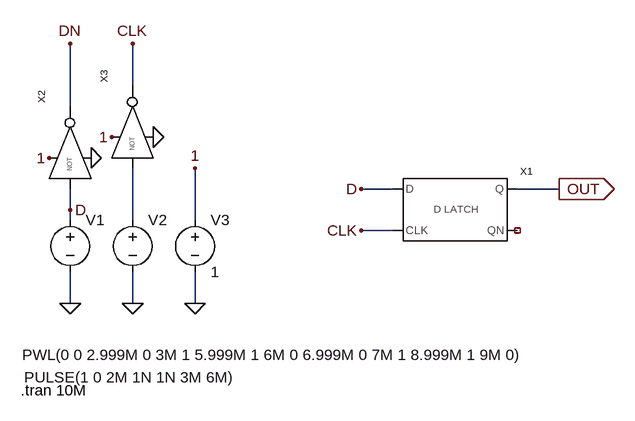
[diagram p0: schematic Draft37.asc]
Draft37.asc, the LTspice schematic file:
Version 4
SHEET 1 880 680
WIRE -352 -16 -352 -80
WIRE -448 16 -448 -80
WIRE 48 144 0 144
WIRE 304 144 240 144
WIRE -448 176 -448 144
WIRE -448 192 -448 176
WIRE -352 192 -352 112
WIRE -256 192 -256 112
WIRE 48 208 0 208
WIRE -448 320 -448 272
WIRE -352 320 -352 272
WIRE -256 320 -256 272
FLAG -448 320 0
FLAG -352 320 0
FLAG -416 96 0
FLAG -256 112 1
FLAG -480 96 1
FLAG -448 -80 DN
FLAG -448 176 D
FLAG -352 -80 CLK
FLAG -256 320 0
FLAG -384 64 1
FLAG -320 64 0
FLAG 0 144 D
FLAG 0 208 CLK
FLAG 304 144 OUT
IOPIN 304 144 Out
SYMBOL D_LATCH 128 176 R0
SYMATTR InstName X1
SYMBOL voltage -448 176 R0
WINDOW 3 -74 223 Left 2
WINDOW 123 0 0 Left 0
WINDOW 39 0 0 Left 0
SYMATTR Value PWL(0 0 2.999M 0 3M 1 5.999M 1 6M 0 6.999M 0 7M 1 8.999M 1 9M 0)
SYMATTR InstName V1
SYMBOL voltage -352 176 R0
WINDOW 3 -167 258 Left 2
WINDOW 123 0 0 Left 0
WINDOW 39 0 0 Left 0
SYMATTR Value PULSE(1 0 2M 1N 1N 3M 6M)
SYMATTR InstName V2
SYMBOL NOT4 -432 80 R270
SYMATTR InstName X2
SYMBOL voltage -256 176 R0
WINDOW 123 0 0 Left 0
WINDOW 39 0 0 Left 0
SYMATTR InstName V3
SYMATTR Value 1
SYMBOL NOT4 -336 48 R270
SYMATTR InstName X3
TEXT -524 454 Left 2 !.tran 10M

The netlist it stands for:
* Draft37.asc
XX1 D CLK OUT NC_01 D_LATCH  ; pins D CLK Q QN
V1 D 0 PWL(0 0 2.999M 0 3M 1 5.999M 1 6M 0 6.999M 0 7M 1 8.999M 1 9M 0)
V2 N001 0 PULSE(1 0 2M 1N 1N 3M 6M)
XX2 D 1 0 DN NOT4  ; pins A VH VL OUT
V3 1 0 1
XX3 N001 1 0 CLK NOT4  ; pins A VH VL OUT
.tran 10M
.backanno
.end